# Altium schematic sheet UPN.SchDoc
size 420 x 297 mm; Address1: Address1; Address2: Address2; Address3: Address3; Address4: Address4; DocumentNumber: АБВГ.123456.001 Э3; SheetNumber: 1; Scale: 1:1; DocumentType: Схема электрическая принципиальная; FirstReferrence: АБВГ.123456.001
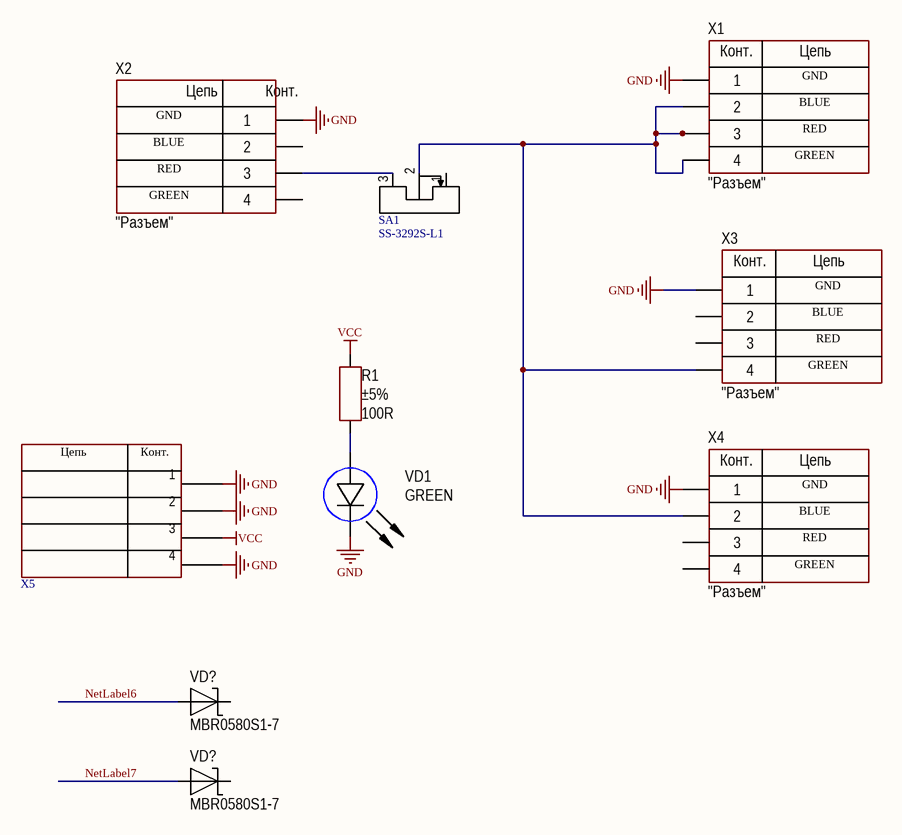
[diagram p0: UPN.SchDoc]

## Parts
(Parts that share a designator on the sheet are numbered #1, #2 ... from top to bottom, then left to right.)
R1  value 100R  Tolerance: ±5%  [RES: 0603]
SA1  SS-3292S-L1  [SS-3292S-L1]
VD1  Color: GREEN  [LED: 0805G]
VD?#1  PartNumber: MBR0580S1-7  [DIODE: SOD523]
VD?#2  PartNumber: MBR0580S1-7  [DIODE: SOD523]
X1  CommentText: "Разъем"  [4PLS RIGHT ANGLE 2]
X2  CommentText: "Разъем"  [CON: PBS-4 R]
X3  CommentText: "Разъем"  [4PLS RIGHT ANGLE 2]
X4  CommentText: "Разъем"  [4PLS RIGHT ANGLE 2]
X5  PBS-4 cut  [PBS-4 CUT]  (value not drawn)

## Nets
GND: VD1.2(C) X1.1 X2.1 X3.1 X4.1 X5.1 X5.2 X5.4
VCC: R1.2 X5.3
NetLabel6: VD?#1.1
NetLabel7: VD?#2.1
NetR1_1: R1.1 VD1.1(A)
NetSA1_2: SA1.2 X1.2 X1.3 X1.4 X3.4 X4.2
NetSA1_3: SA1.3 X2.3

Not connected (* = marked no-connect by the designer): SA1 1; VD?#1 2; VD?#2 2; X2 2 4; X3 2 3; X4 3 4

## Notes on the sheet
- (near X1) GND
- (near X1) BLUE
- (near X2) GND
- (near X2) RED
- (near X2) BLUE
- (near X1) RED
- (near X1) GREEN
- (near X2) GREEN
- (near X3) GND
- (near X3) BLUE
- (near X3) RED
- (near X3) GREEN
- (near X4) GND
- (near X4) BLUE
- (near X4) RED
- (near X4) GREEN
- Перв. примен.
- Справ. №
- Подп. и дата
- Инв. № дубл.
- Взам. инв. №
- Разраб.
- Изм.
- Лист
- № докум.
- Подп.
- Дата
- Лит.
- Масса
- Масштаб
- Пров.
- Т.контр.
- Листов
- Инв. № подл.
- Утв.
- Н.контр.
- 2.106-A3
- Копировал
- Формат А3
- (in symbol PBS-4) Цепь; Конт.
- (in symbol PBS-4 cut) Цепь; Конт.
- (in symbol PLS-4) Конт.; Цепь

## Library data of the parts
R1 = Resistor_0603: Manufacturer: Yageo; PartNumber: RC0603JR-07100RL; ValueManufacturerPartNumber: Resistor film, 100R, ±5%, 0603, 0.1W, -55...+125°C; TypeResistor: Resistor film; Power: 0.1W; Package: 0603; HelpURL: https://www.digikey.com/product-detail/en/yageo/RC0603JR-07100RL/311-100GRCT-ND/729644; Temperature: -55...+125°C
VD1 = LED_single: ValueManufacturerPartNumber: LED, *, *, *, -55...+150°C; TypeDiode: LED; Manufacturer: *; Package: *; HelpURL: *; Temperature: -55...+150°C; Current: *; VoltageDrop: *; PartNumber: *
VD?#1 VD?#2 = Schottky_single: Manufacturer: Diodes Incorporated; ValueManufacturerPartNumber: Schottky diode, 80V, 500mA, 1V, 15pF, SOD-123, -55...+150°C; TypeDiode: Schottky diode; Voltage: 80V; Current: 500mA; VoltageDrop: 1V; RecoveryTime: 15pF; Package: SOD-123; HelpURL: https://www.digikey.com/product-detail/en/diodes-incorporated/MBR0580S1-7/MBR0580S1-7DICT-ND/5080371; Temperature: -55...+150°C
X1 X3 X4 = PLS-4: Manufacturer: Connfly; ValueManufacturerPartNumber: Connector, 4pin, 2.54mm, 500VAC, 3A; TypeConnector: Connector; VoltageMax: 500VAC; Pitch: 2.54mm; CurrentMax: 3A; Multichannel: 4pin; HelpURL: https://www.chipdip.ru/product/pls-4; PartNumber: PLS-4
X2 = PBS-4: Manufacturer: Connfly; ValueManufacturerPartNumber: Connector, 4pin, 2.54mm, 500VAC, 3A; TypeConnector: Connector; VoltageMax: 500VAC; Pitch: 2.54mm; CurrentMax: 3A; Multichannel: 4pin; HelpURL: https://www.chipdip.ru/product/pbs-4; PartNumber: PBS-4